# EasyEDA schematic DATA recorder.json
TITLE: New Schematic; REV: 1.0; Date: 2018-09-23; Sheet: 1/1; Drawn By: danulo004
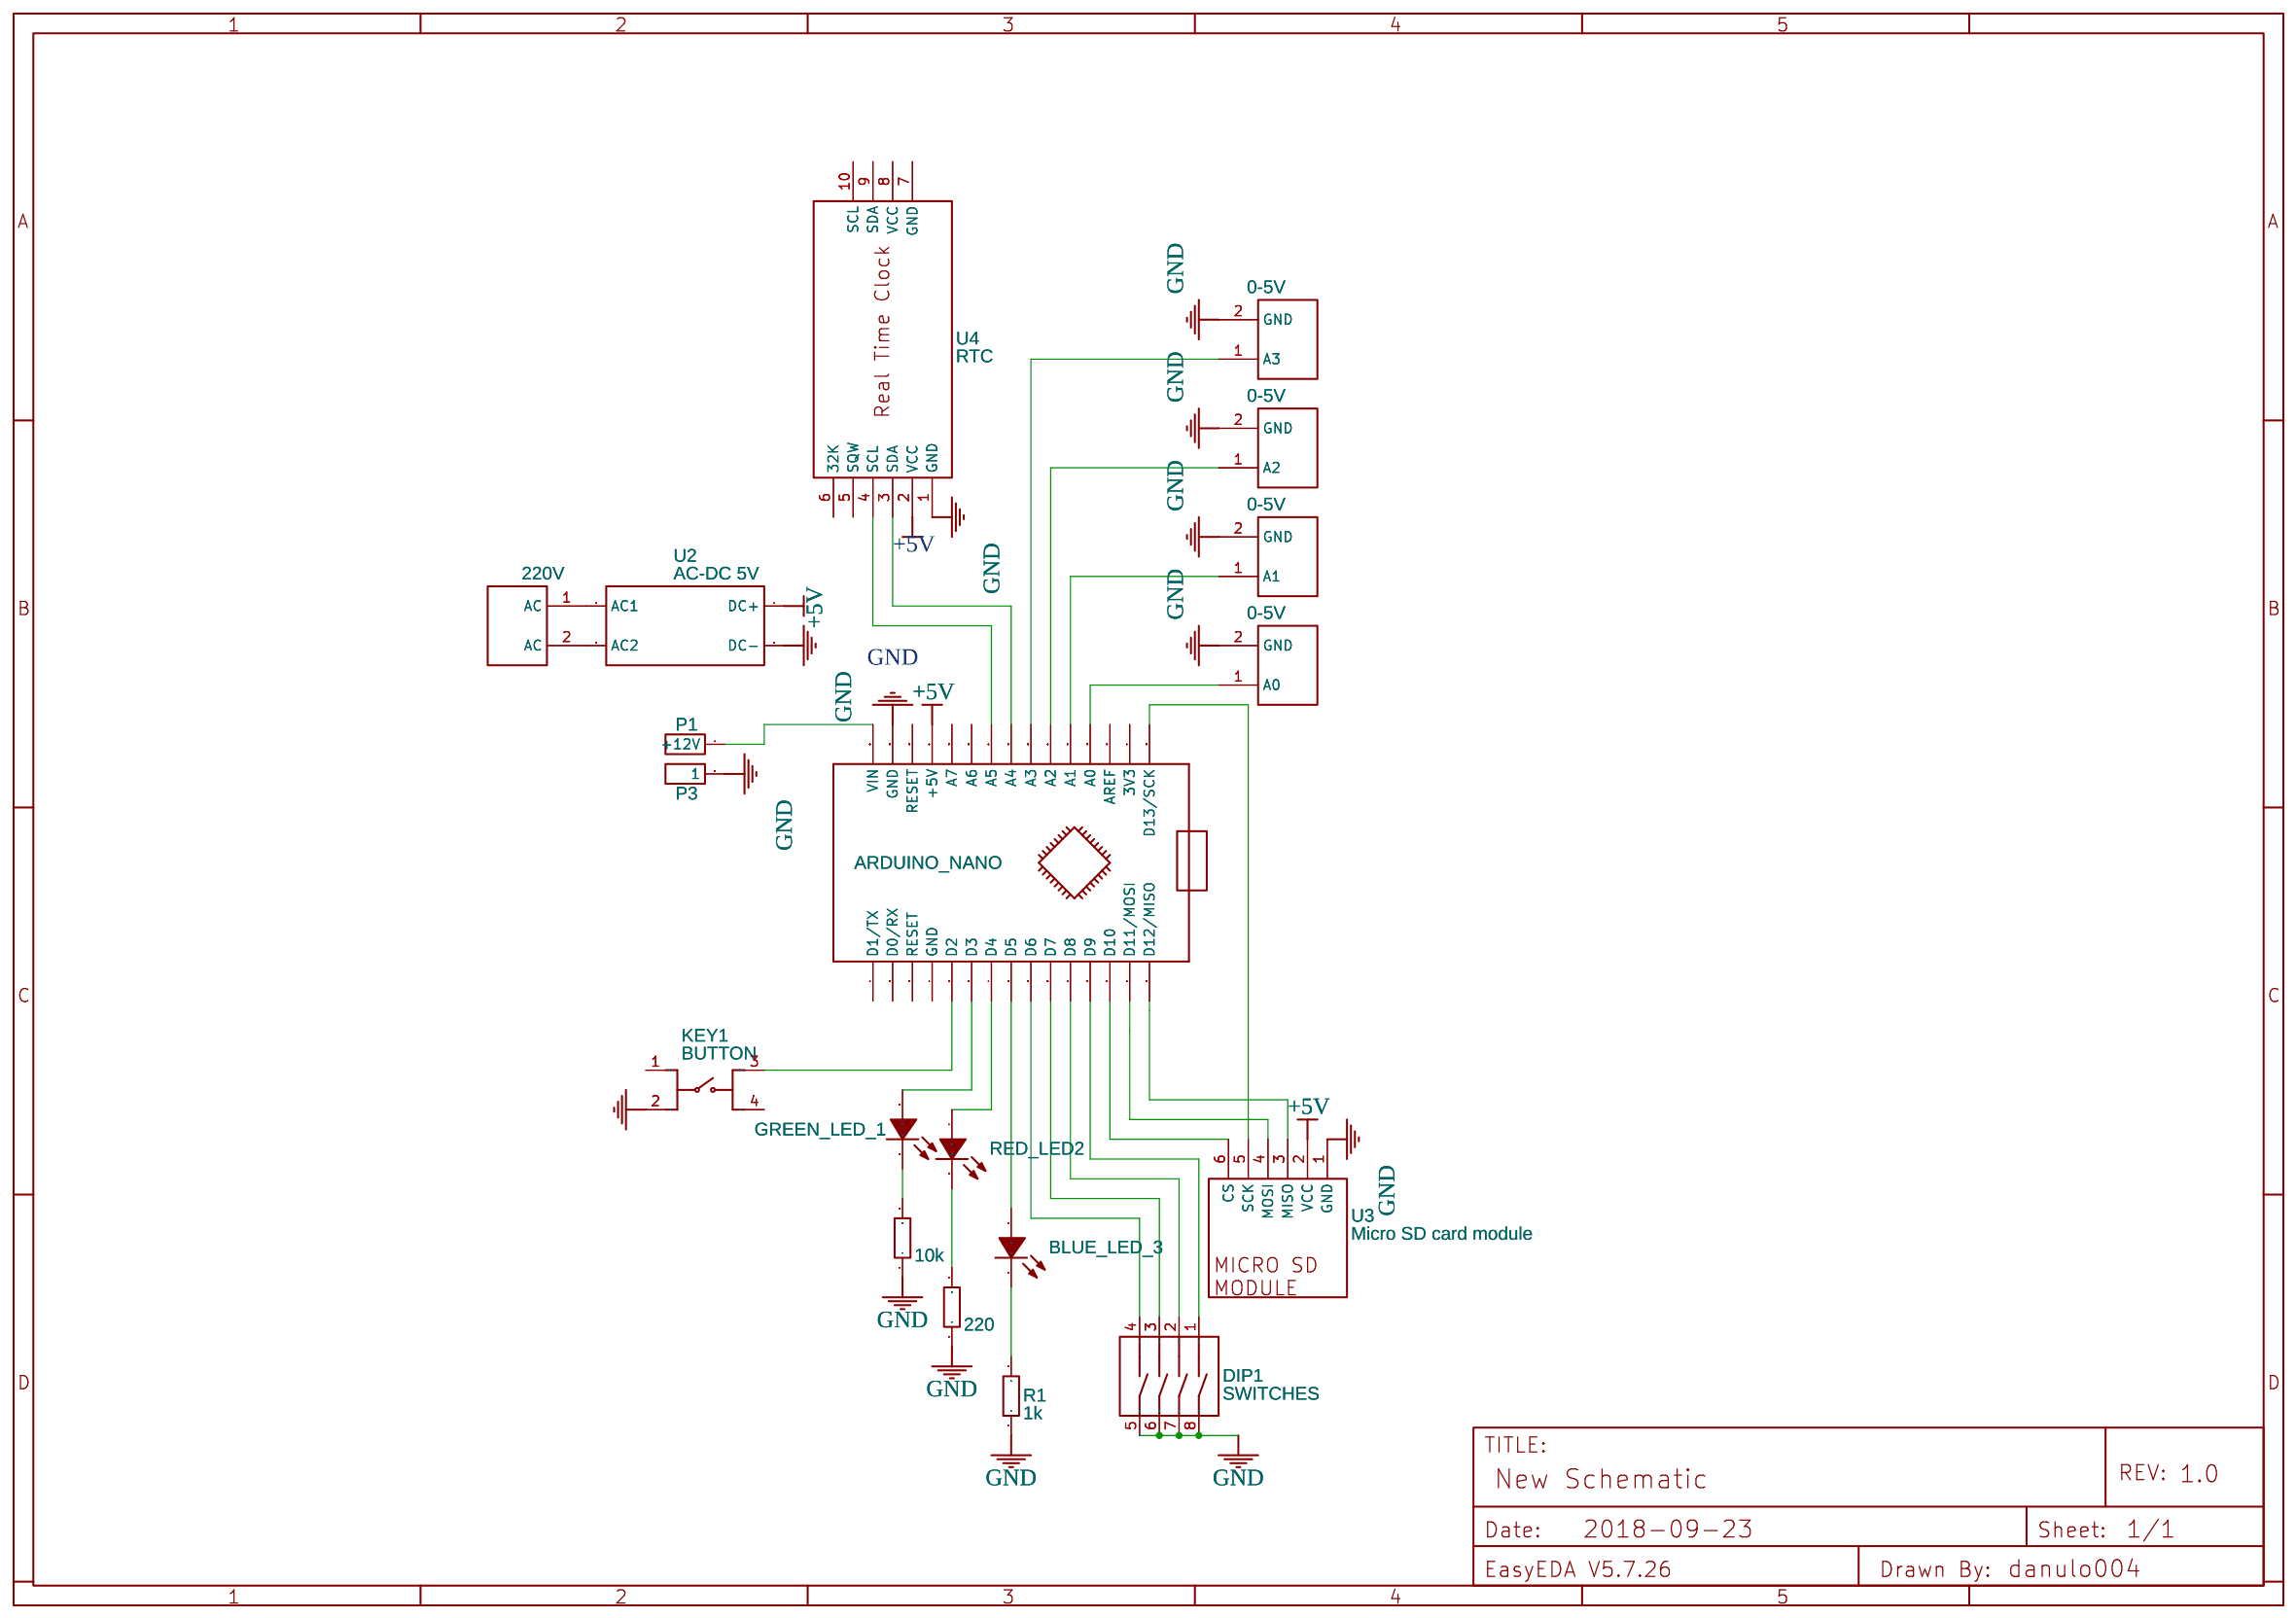
[diagram p0: schematic sheet]

## Parts
BLUE_LED_3  LEDOrange orange 3AO4UD  [LED-3MM]
C  220V  [KF301]
CN1  0-5V  [KF301]
CN2  0-5V  [KF301]
CN3  0-5V  [KF301]
CN4  0-5V  [KF301]
DIP1  SWITCHES  [VDG/S-04HG-R]
GREEN_LED_1  LEDOrange orange 3AO4UD  [LED-3MM]
KEY1  BUTTON  [KEY-6.0*6.0-2]
P1  Header-Male-2.54_1x1  [HDR-1X1/2.54]
P3  Header-Male-2.54_1x1  [HDR-1X1/2.54]
R1  1k  [AXIAL-0.4]
R2  220  [AXIAL-0.4]
R3  10k  [AXIAL-0.4]
RED_LED2  LEDOrange orange 3AO4UD  [LED-3MM]
U1  ARDUINO_NANO  [ARDUINO_NANO]
U2  AC-DC 5V  [HLK-PM01]
U3  Micro SD card module  [MICRO SD CARD MODULE]
U4  RTC  [RTC_PCB]

## Library data of the parts
BLUE_LED_3 GREEN_LED_1 RED_LED2 = -: Supplier: LCSC; Manufacturer: KENTO; image: //image.lceda.cn/szlcsc/C62095.jpg; Contributor: LCSC; Supplier Part: C62095
C CN1-CN4 = -: Contributor: targence; Manufacturer Part: ?
DIP1 = -: Supplier Part: C15781; Supplier: LCSC; Manufacturer: ReliaPro; image: //image.lceda.cn/szlcsc/C15781.jpg
KEY1 = -: Supplier Part: C111609; Supplier: LCSC; Manufacturer: SOFNG; Manufacturer Part: TS-1102-5016; Contributor: EasyEDA
P1 P3 = -: Supplier Part: C81276; Supplier: LCSC; Manufacturer: ReliaPro
R1-R3 = Res_AXIAL-0.4(1/4W)_EU: Manufacturer Part: ?
U1 = -: sourceId: KGSeAWhDB; Manufacturer Part: ?
U2 = -: sourceId: u1BzxTRca; Manufacturer Part: ?
U3 = -: Contributor: yottazoid; Manufacturer Part: ?
U4 = -: Manufacturer Part: ?; Contributor: Данило Рубаха

## Nets
+5V: U1.27(+5V) U2.4(DC+) U3.2(VCC) U4.2(VCC)
GND: CN1.2(GND) CN2.2(GND) CN3.2(GND) CN4.2(GND) DIP1.5 DIP1.6 DIP1.7 DIP1.8 KEY1.2 P3.1 R1.1 R2.1 R3.1 U1.29(GND) U2.3(DC-) U3.1(GND) U4.1(GND)
Net-(BLUE_LED_3-1): BLUE_LED_3.1(A) U1.8(D5)
Net-(BLUE_LED_3-2): BLUE_LED_3.2(K) R1.2
Net-(C-1): C.1(AC) U2.1(AC1)
Net-(C-2): C.2(AC) U2.2(AC2)
Net-(CN1-1): CN1.1(A0) U1.19(A0)
Net-(CN2-1): CN2.1(A1) U1.20(A1)
Net-(CN3-1): CN3.1(A2) U1.21(A2)
Net-(CN4-1): CN4.1(A3) U1.22(A3)
Net-(DIP1-1): DIP1.1 U1.12(D9)
Net-(DIP1-2): DIP1.2 U1.11(D8)
Net-(DIP1-3): DIP1.3 U1.10(D7)
Net-(DIP1-4): DIP1.4 U1.9(D6)
Net-(GREEN_LED_1-1): GREEN_LED_1.1(A) U1.6(D3)
Net-(GREEN_LED_1-2): GREEN_LED_1.2(K) R3.2
Net-(KEY1-3): KEY1.3 U1.5(D2)
Net-(P1-1): P1.1(+12V) U1.30(VIN)
Net-(R2-2): R2.2 RED_LED2.2(K)
Net-(RED_LED2-1): RED_LED2.1(A) U1.7(D4)
Net-(U1-13): U1.13(D10) U3.6(CS)
Net-(U1-14): U1.14(D11/MOSI) U3.4(MOSI)
Net-(U1-15): U1.15(D12/MISO) U3.3(MISO)
Net-(U1-16): U1.16(D13/SCK) U3.5(SCK)
Net-(U1-23): U1.23(A4) U4.3(SDA)
Net-(U1-24): U1.24(A5) U4.4(SCL)

Not connected (* = marked no-connect by the designer): KEY1 1 4; U1 1(D1/TX) 2(D0/RX) 3(RESET) 4(GND) 17(3V3) 18(AREF) 25(A6) 26(A7) 28(RESET); U4 5(SQW) 6(32K) 7(GND) 8(VCC) 9(SDA) 10(SCL)
